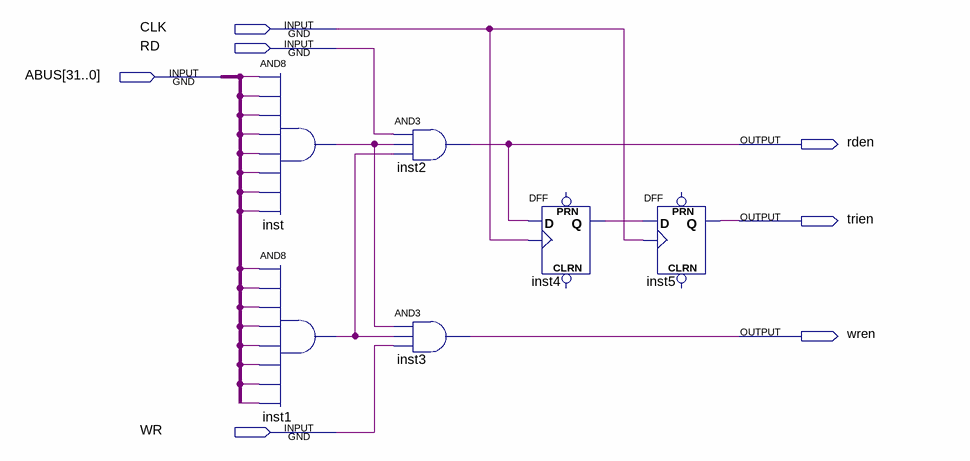
[diagram p0: schematic sheet]
// Quartus schematic sram_perdc.bdf as structural Verilog: 6 symbols, 7 pins
module sram_perdc (
  input  CLK,
  input  RD,
  input  [31:0] ABUS,
  input  WR,
  output rden,
  output trien,
  output wren
);

  wire inst1_out, inst4_q, inst_out;

  and inst (inst_out, ABUS[31], ABUS[30], ABUS[29], ABUS[28], ABUS[27], ABUS[26], ABUS[25], ABUS[24]);
  and inst1 (inst1_out, ABUS[23], ABUS[22], ABUS[21], ABUS[20], ABUS[19], ABUS[18], ABUS[17], ABUS[16]);
  and inst2 (rden, RD, inst_out, inst1_out);
  and inst3 (wren, inst_out, inst1_out, WR);
  DFF inst4 (.CLK(CLK), .D(rden), .Q(inst4_q));  // open: CLRN, PRN
  DFF inst5 (.CLK(CLK), .D(inst4_q), .Q(trien));  // open: CLRN, PRN

  // Other names for the same wires on the sheet: a[31:0] = ABUS
endmodule
